# EasyEDA Pro project Amplificador Logaritmo.eprj

# Schematic Amplificador Logaritmo

## Sheets
1 Fontes: Board Name: Amplificador Logaritmo; Create Date: 2026-05-11; Page Name: Fontes; Project Name: Amplificador Logaritmo; Schematic Name: Amplificador Logaritmo; Update Date: 2026-05-12; Company: EasyEDA.com; Page Size: A4; Version: V1.0
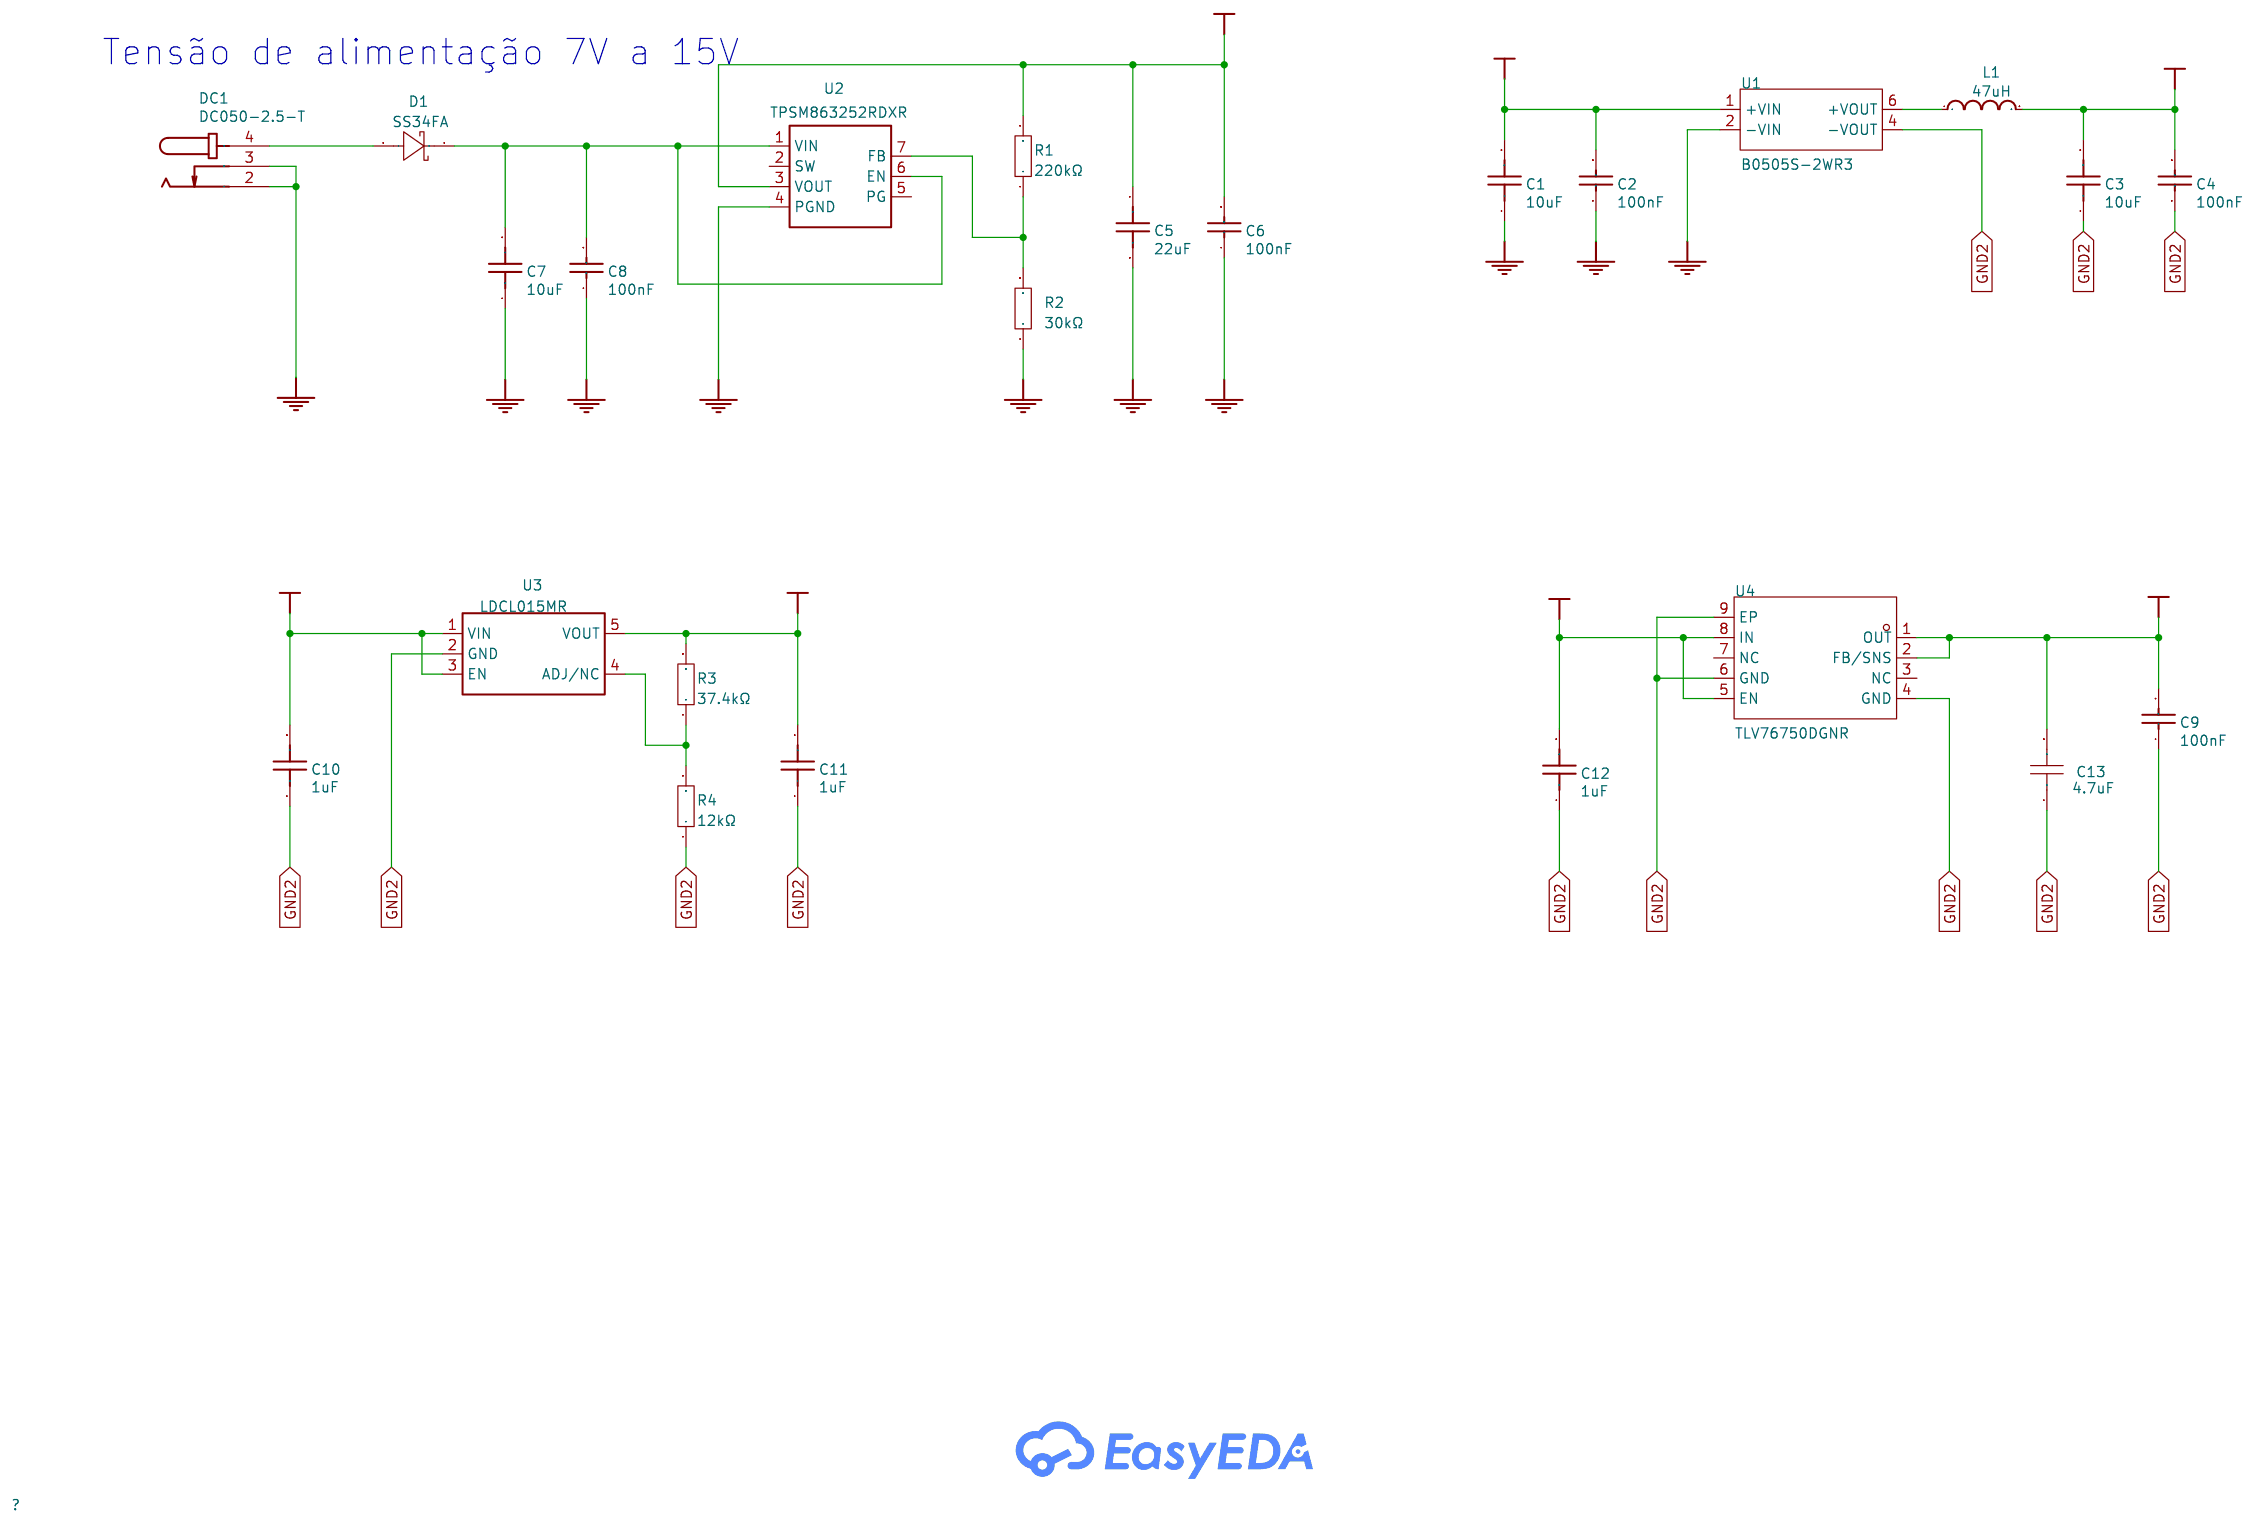
[diagram p0: Fontes]
2 Amplificador 1 e 2: Page Name: Amplificador 1 e 2
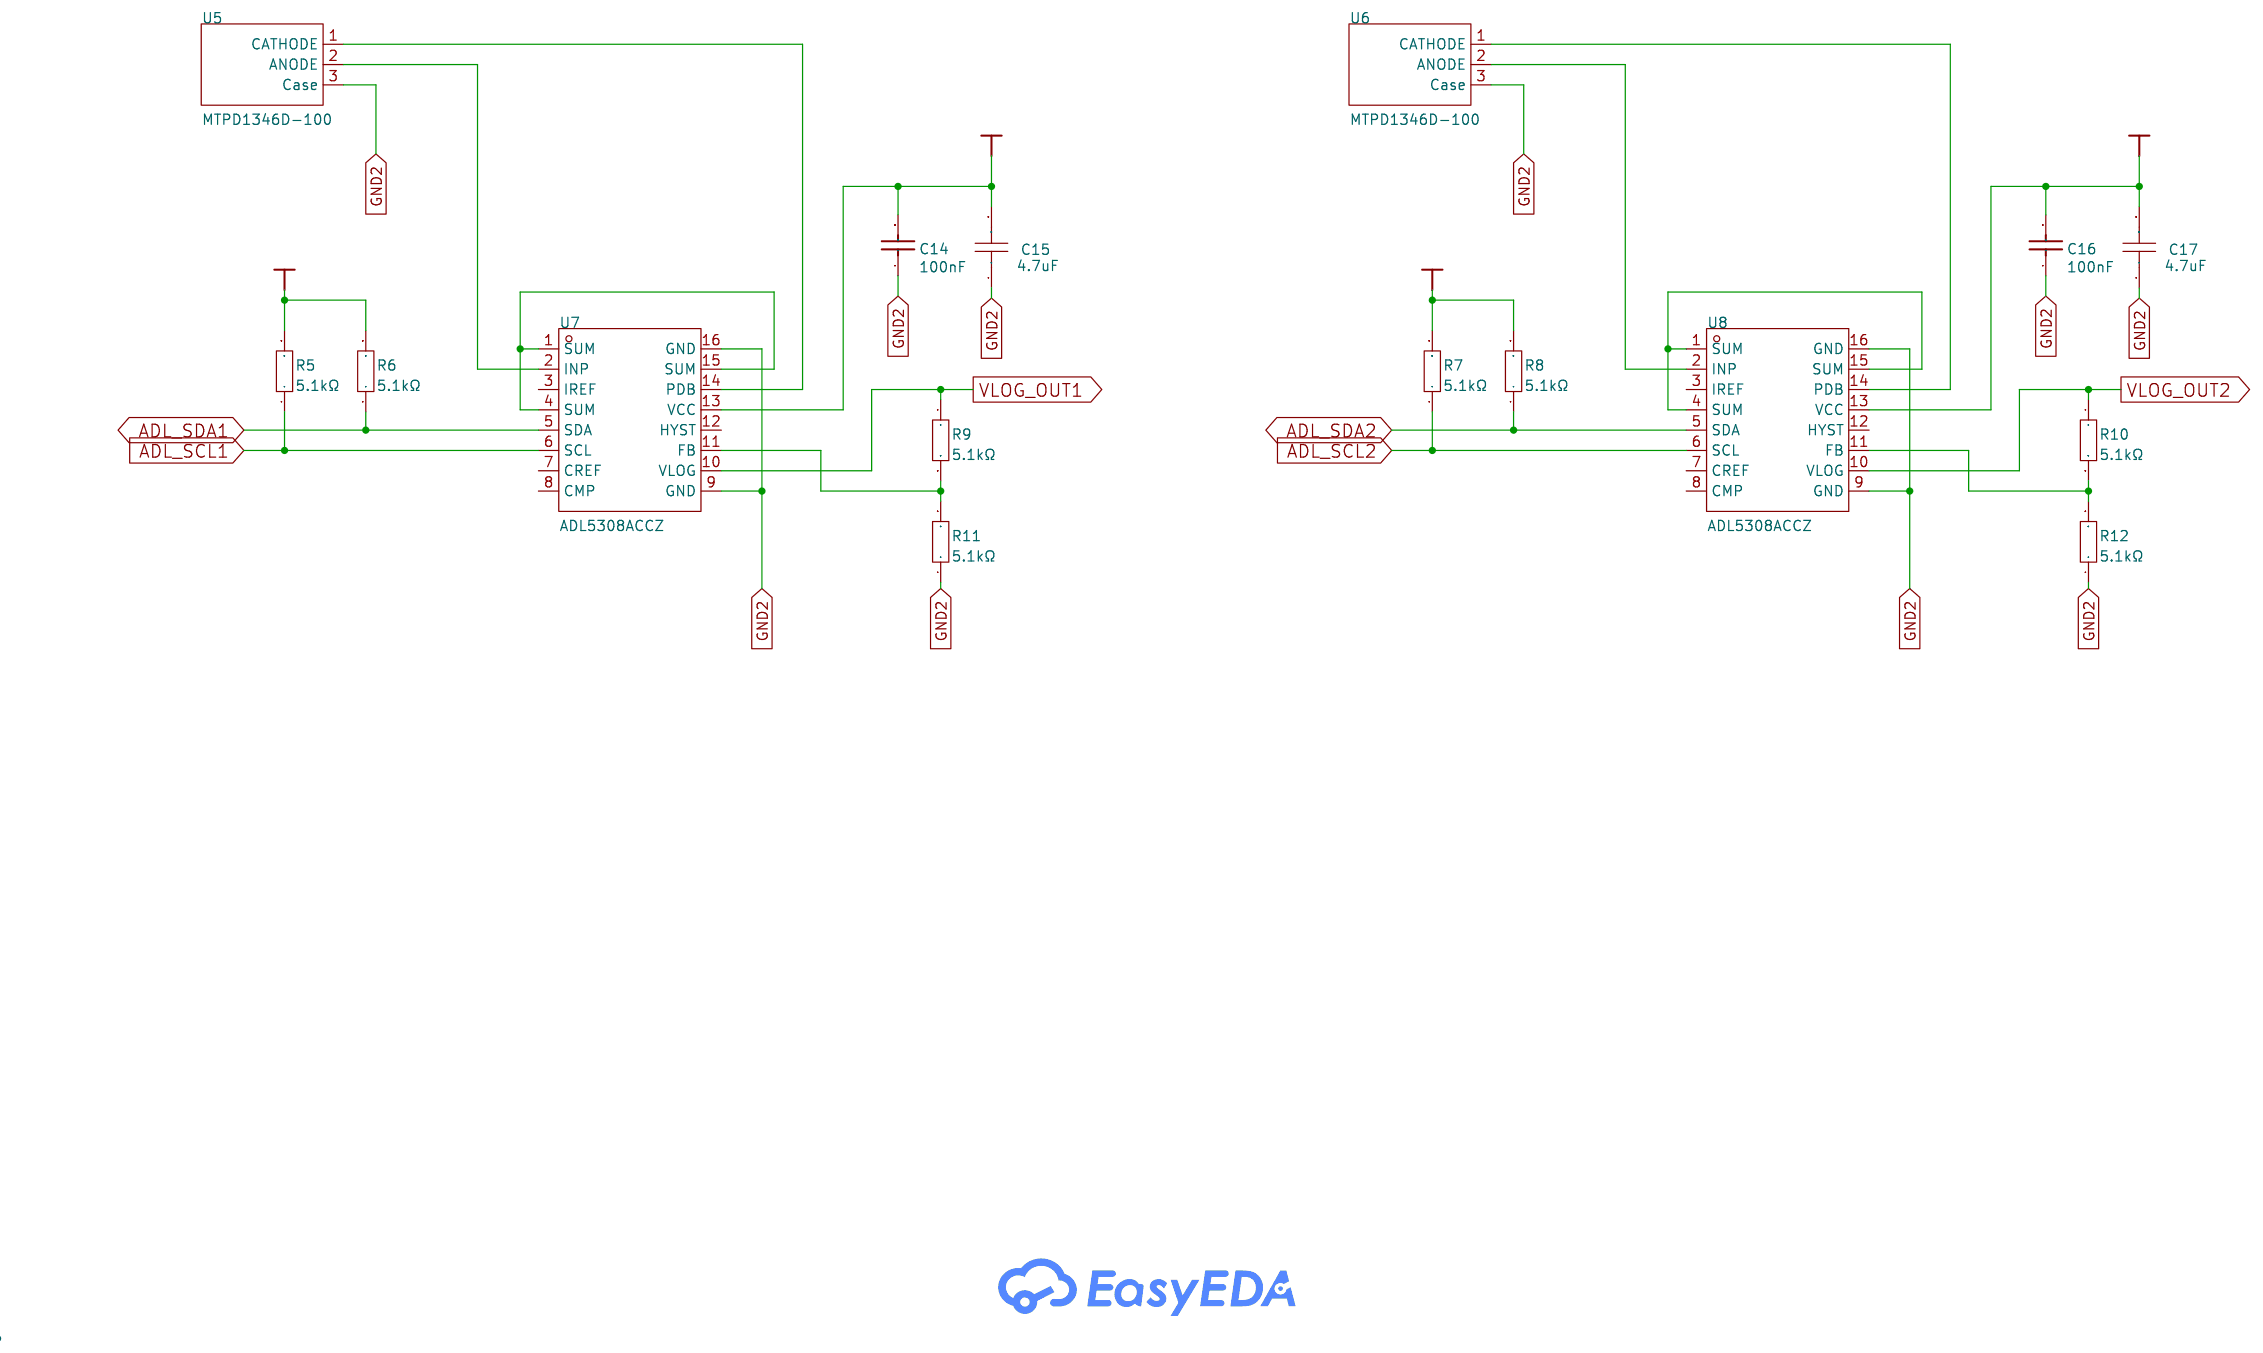
[diagram p1: Amplificador 1 e 2]
3 ADC: Page Name: ADC
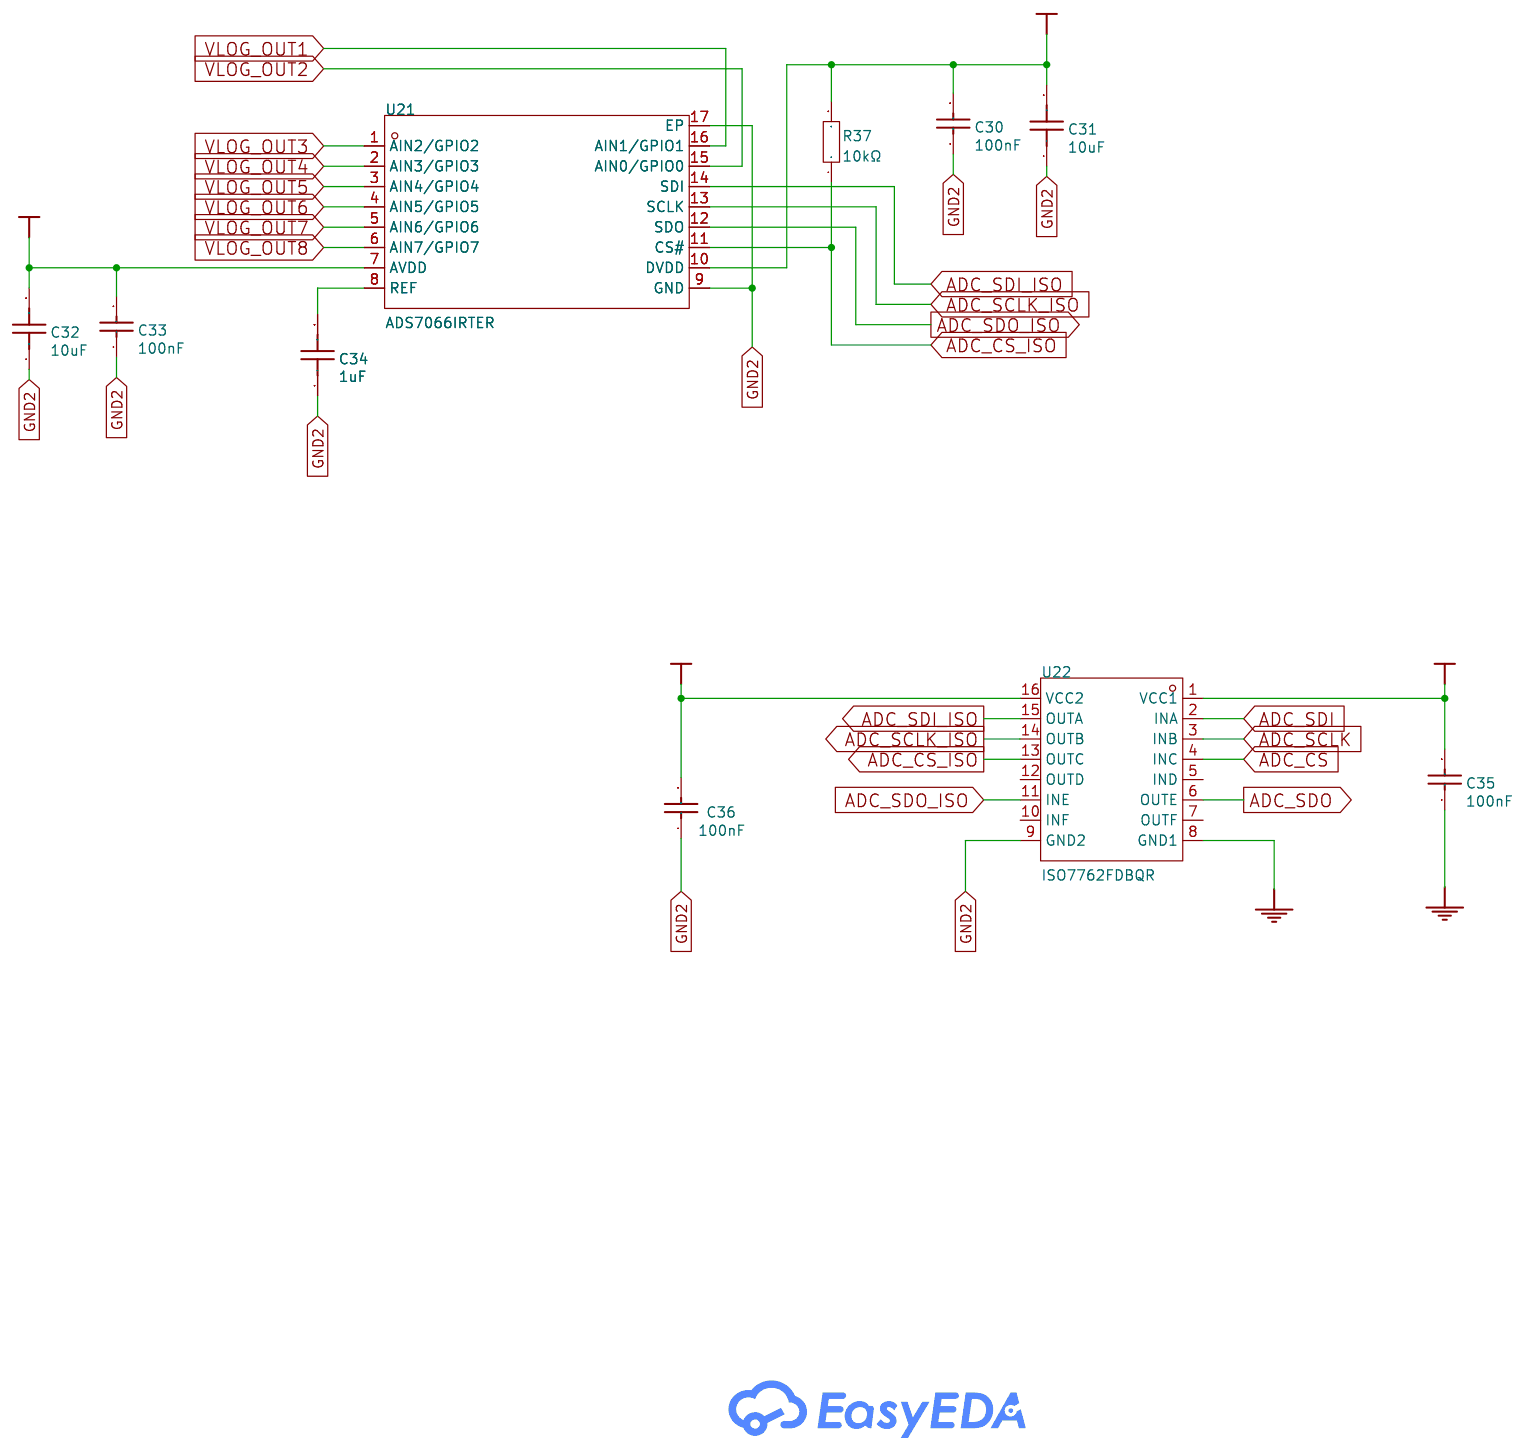
[diagram p2: ADC]
4 Amplificador 3 e 4: Page Name: Amplificador 3 e 4
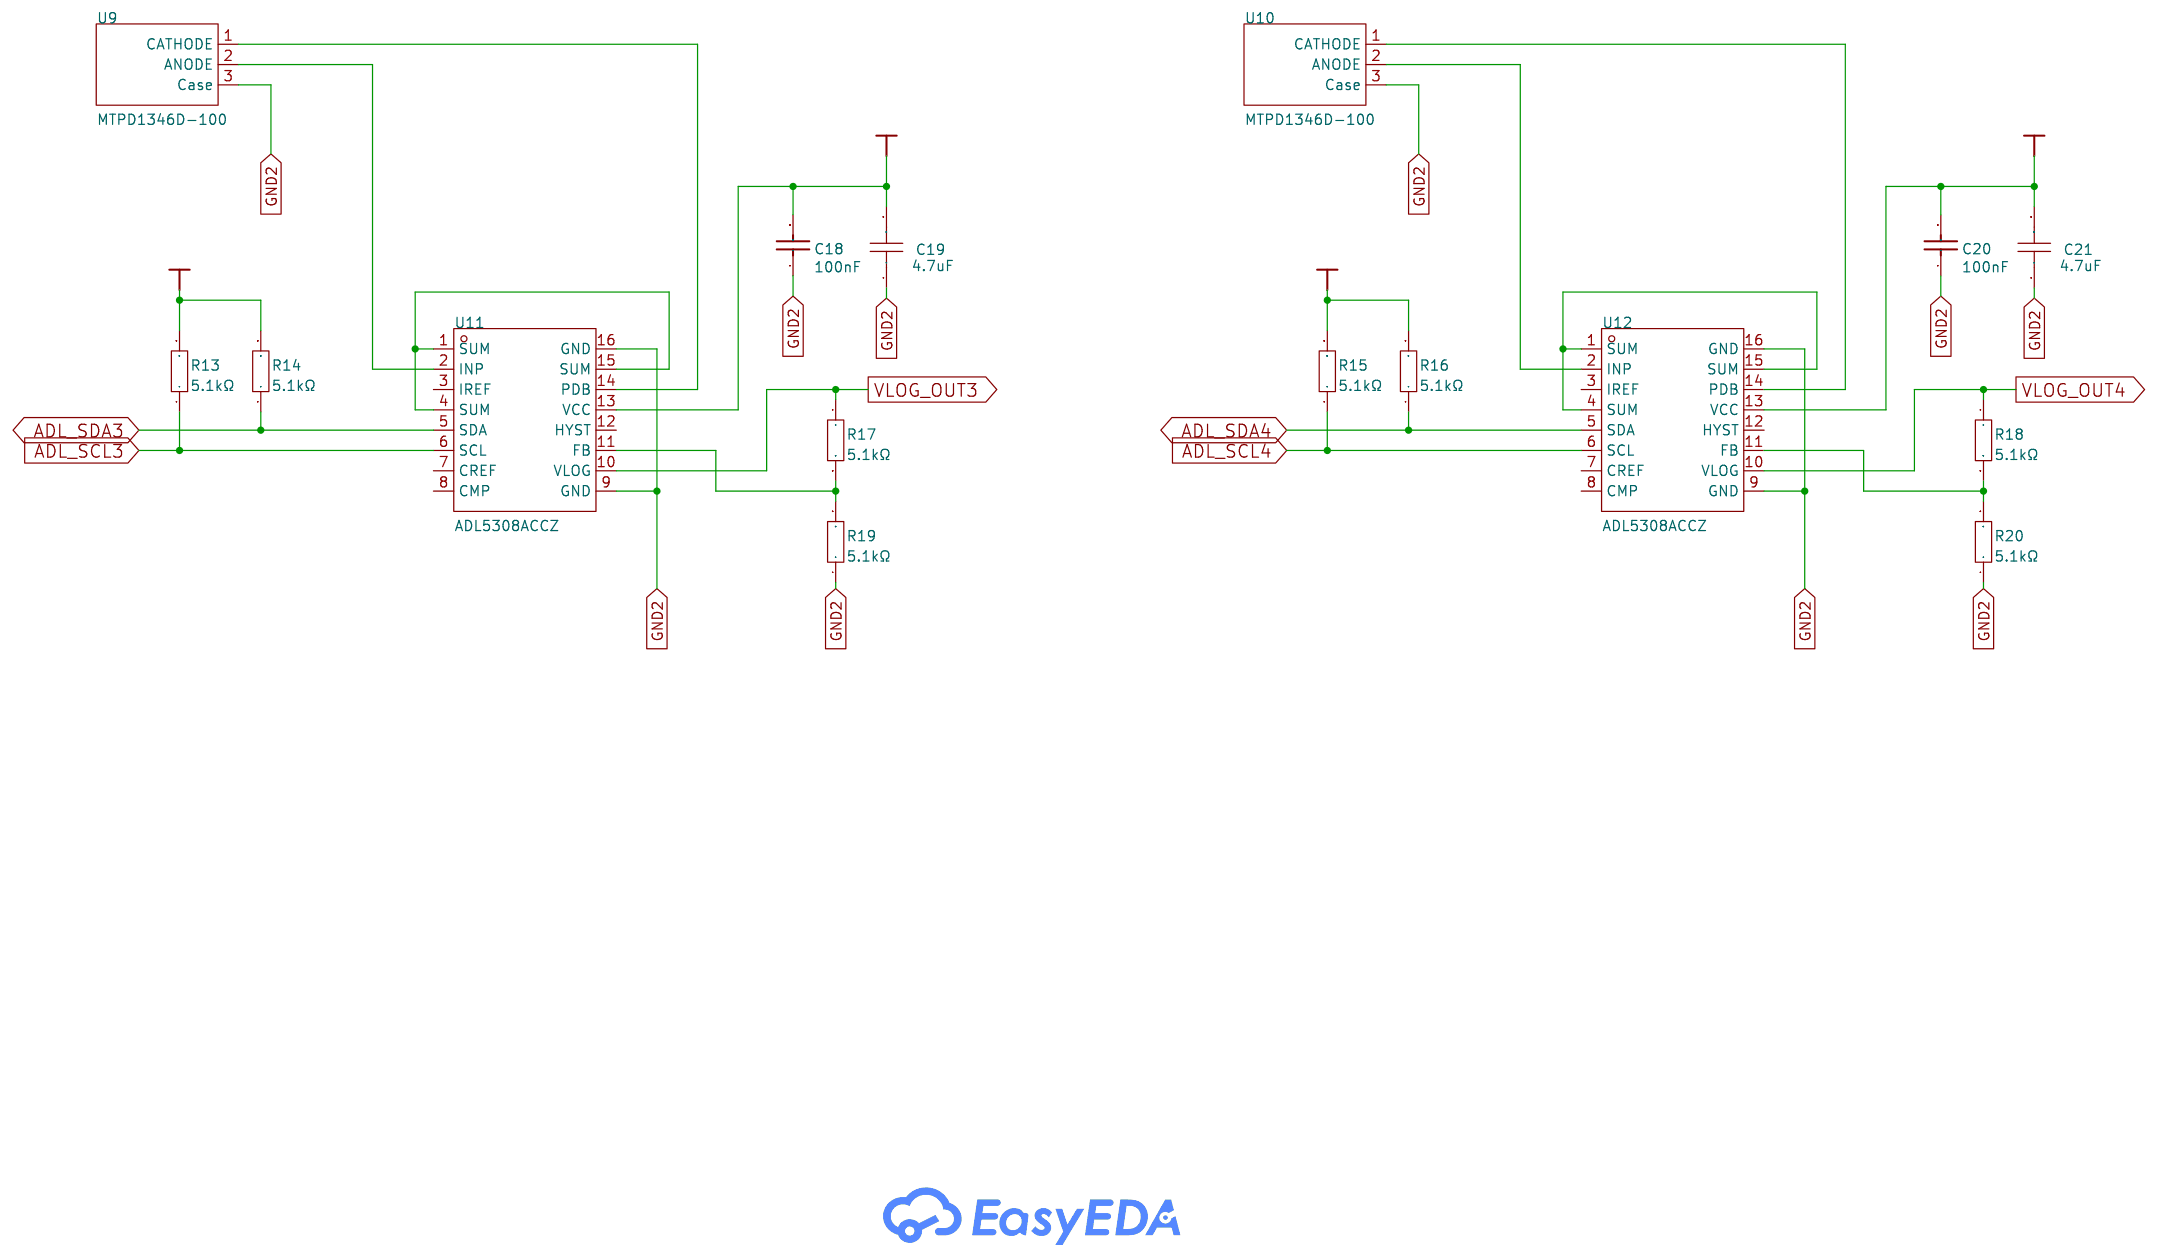
[diagram p3: Amplificador 3 e 4]
5 Amplificador 5 e 6: Page Name: Amplificador 5 e 6
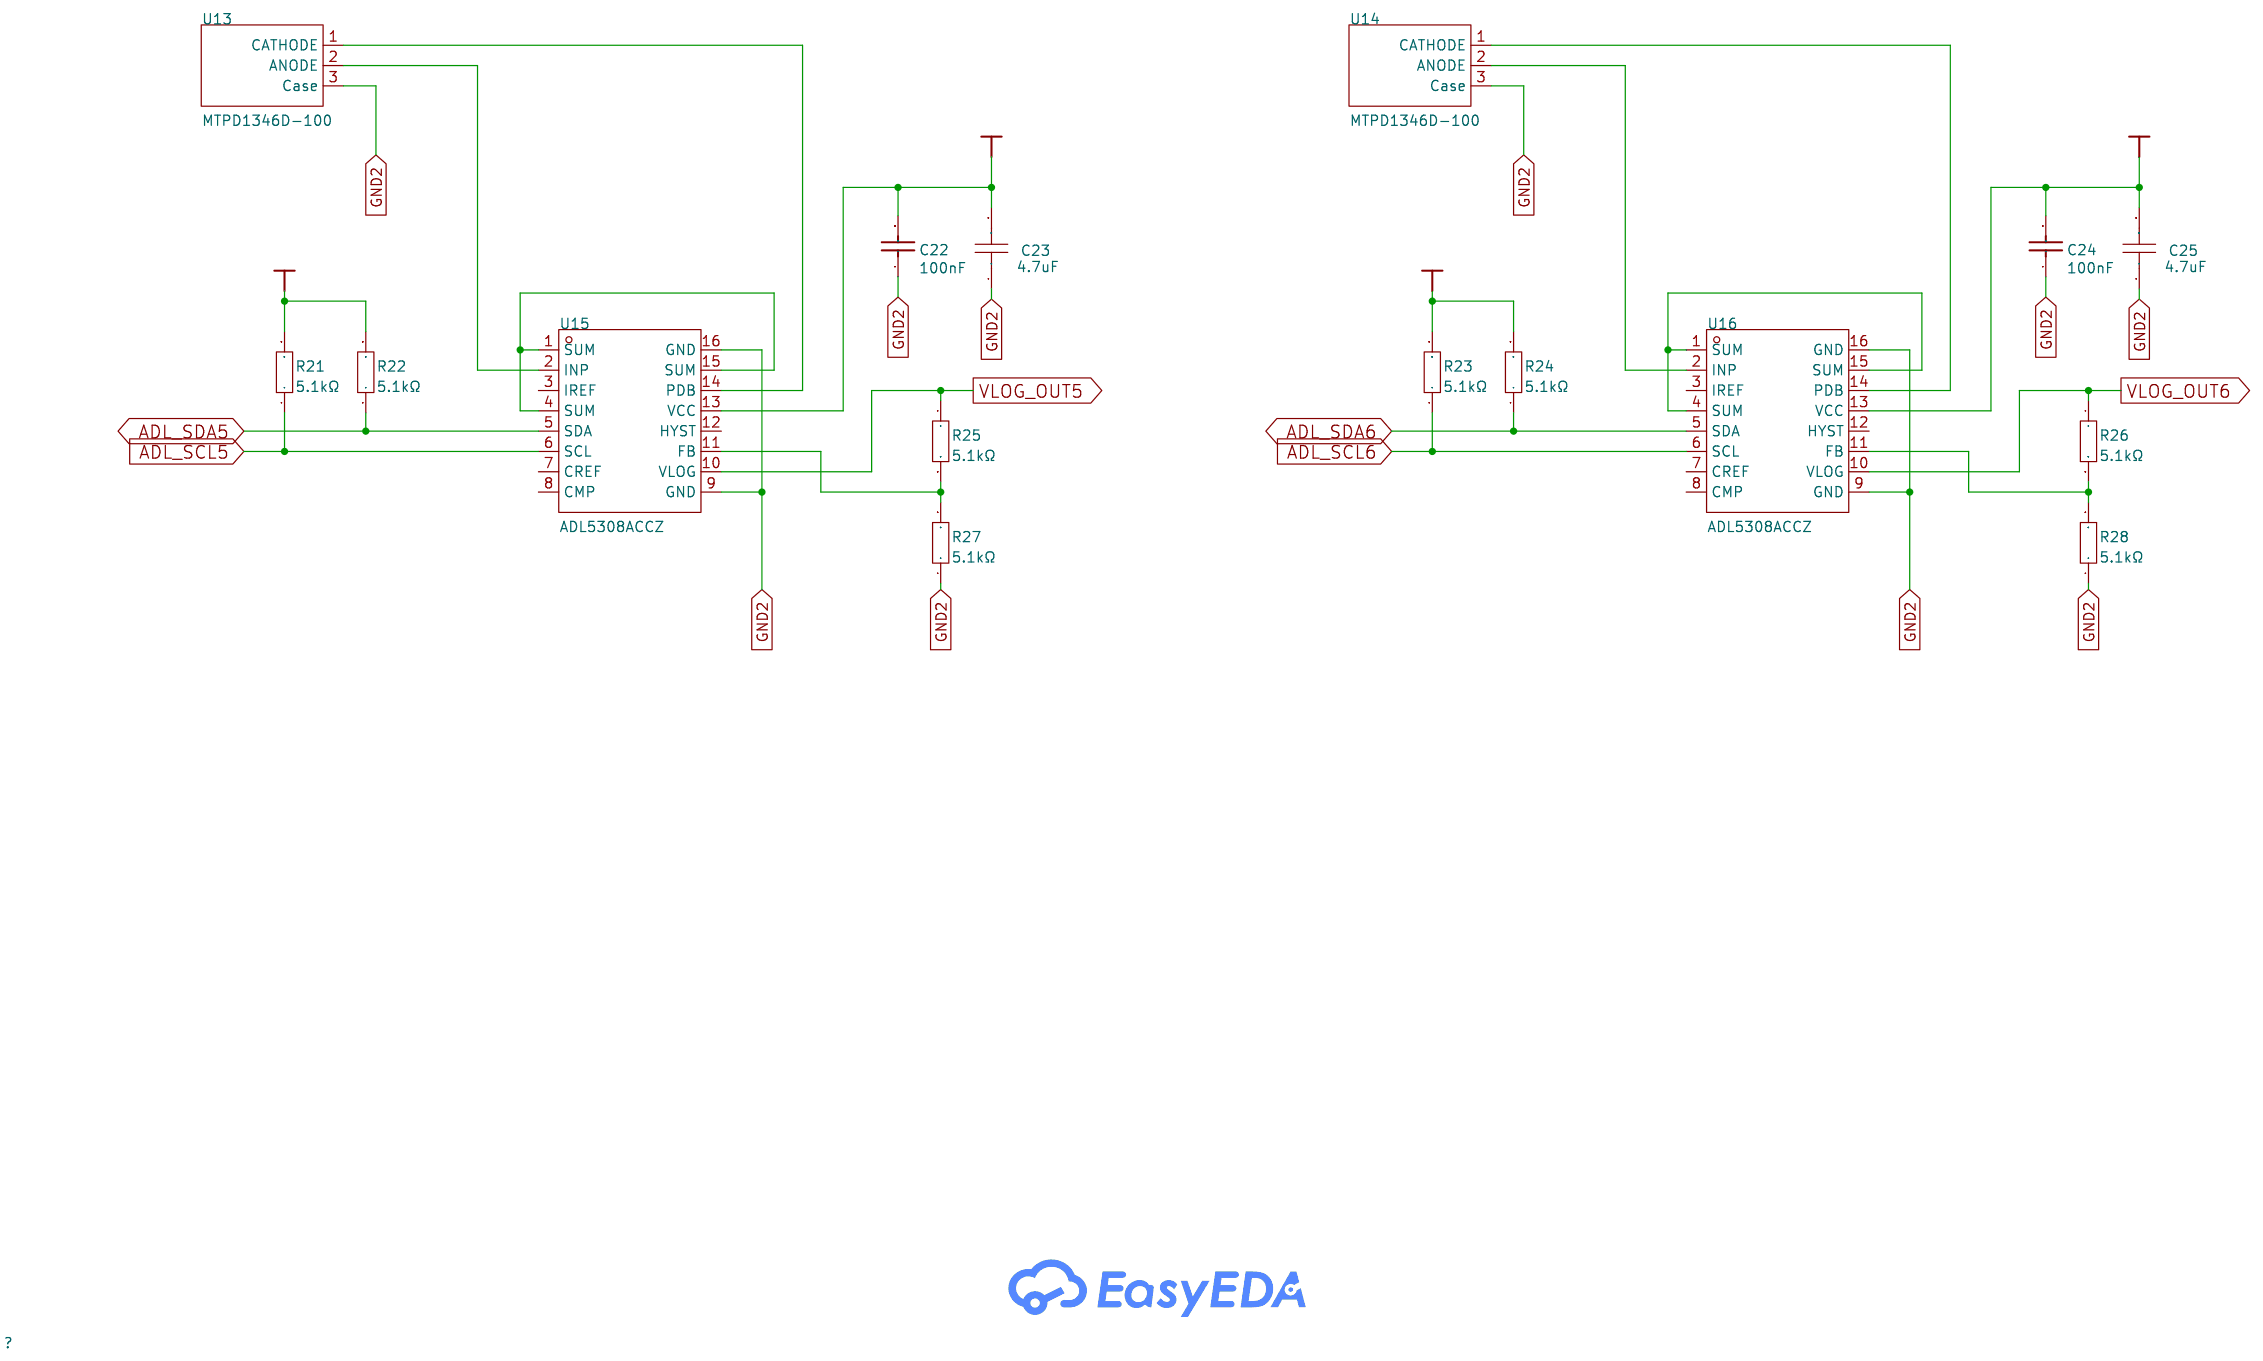
[diagram p4: Amplificador 5 e 6]
6 Amplificador 7 e 8: Page Name: Amplificador 7 e 8
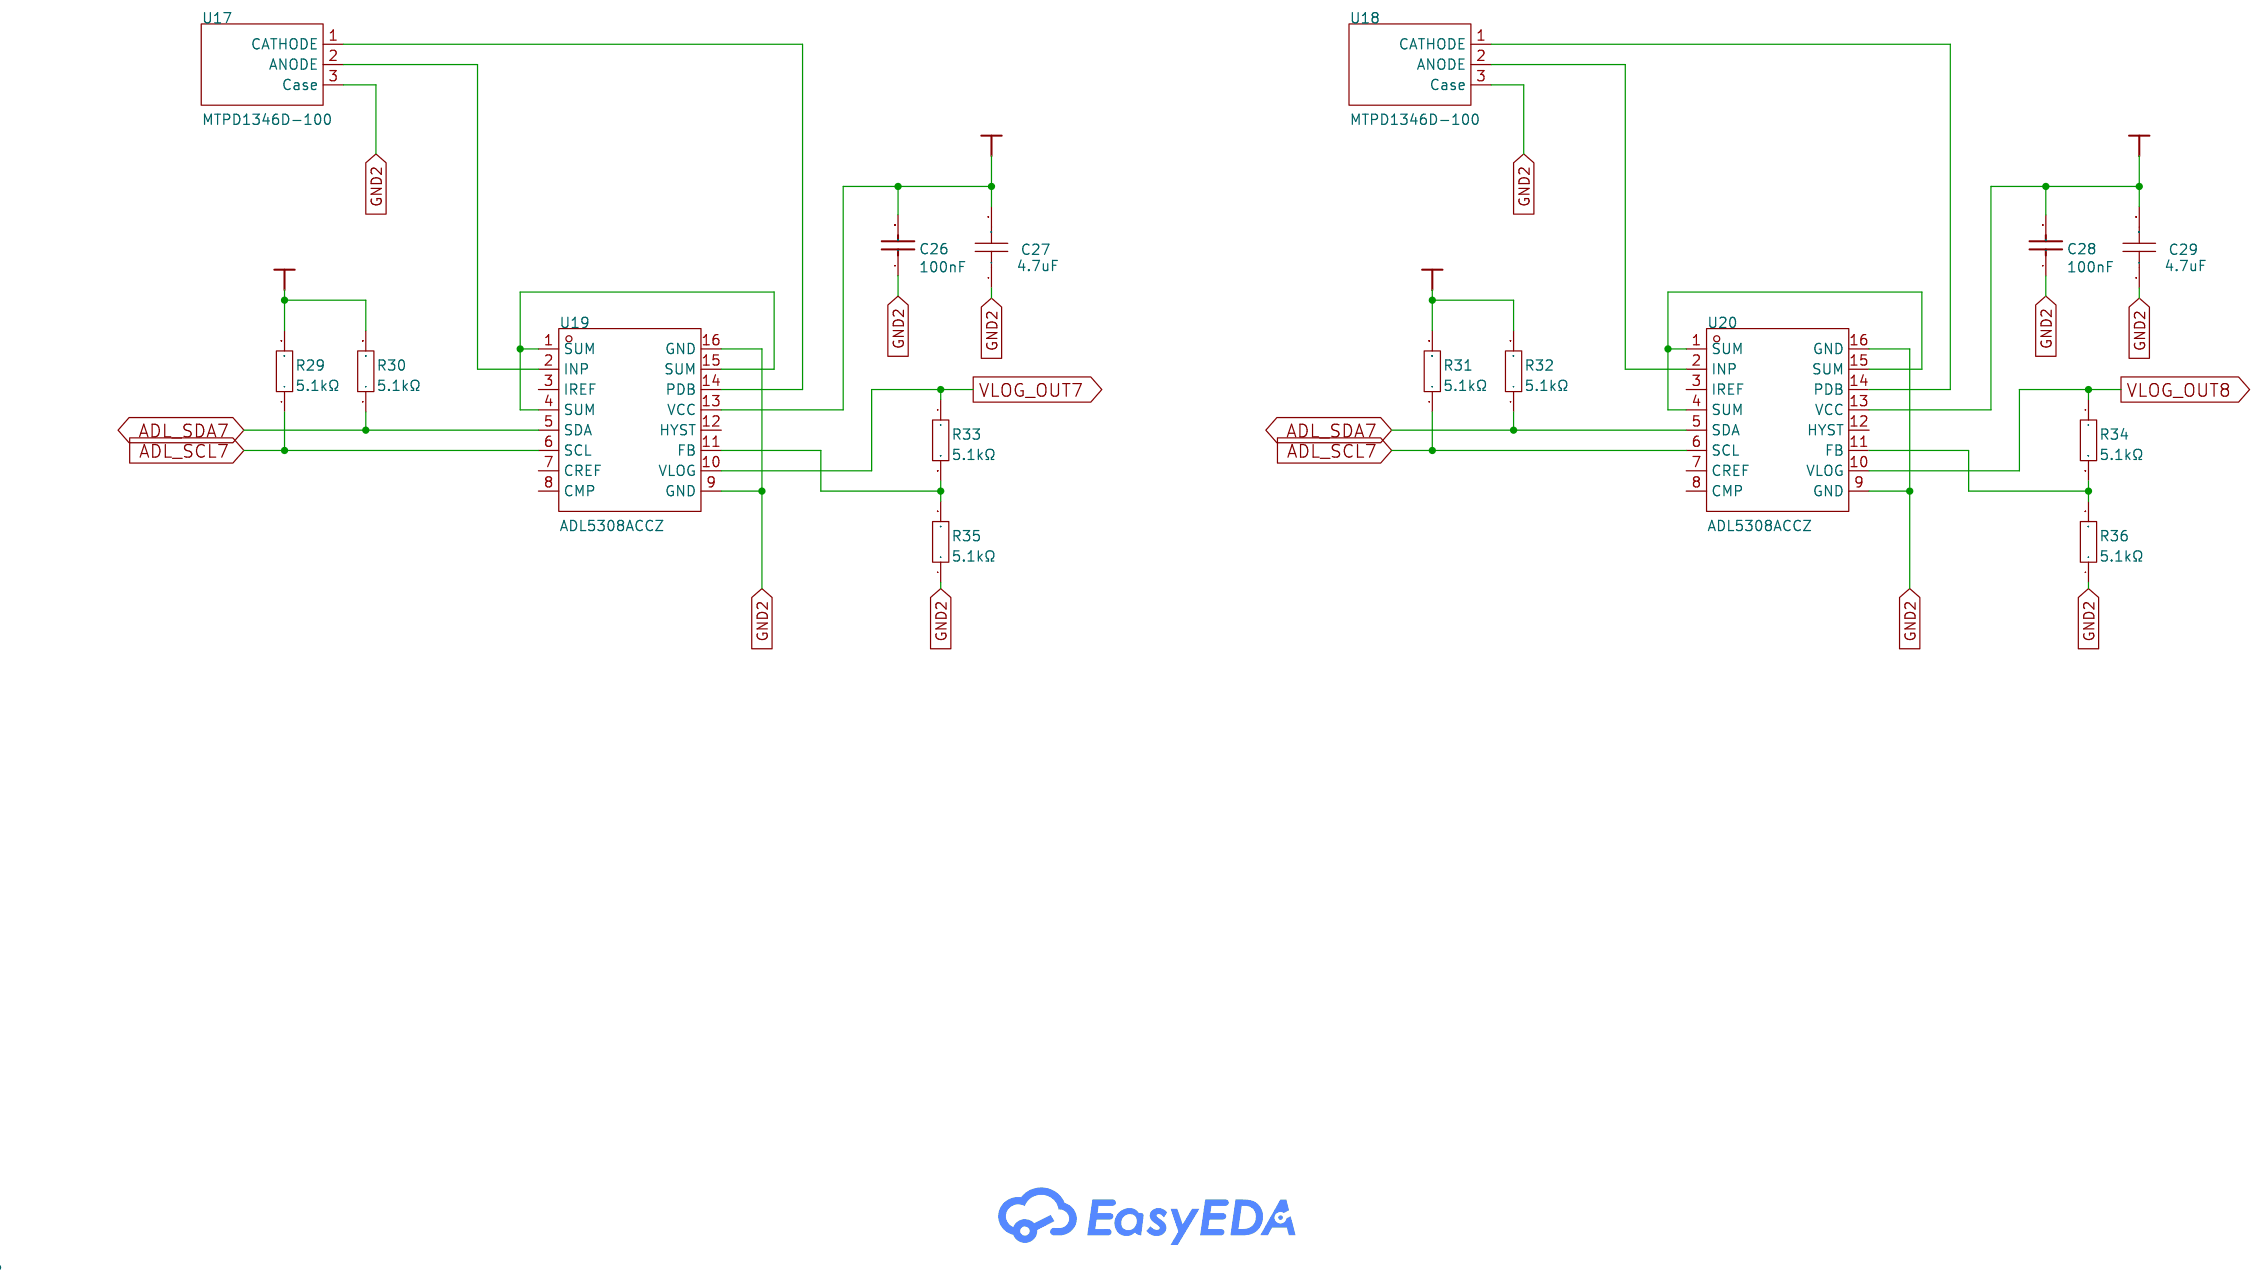
[diagram p5: Amplificador 7 e 8]
7 Interface I2C: Page Name: Interface I2C
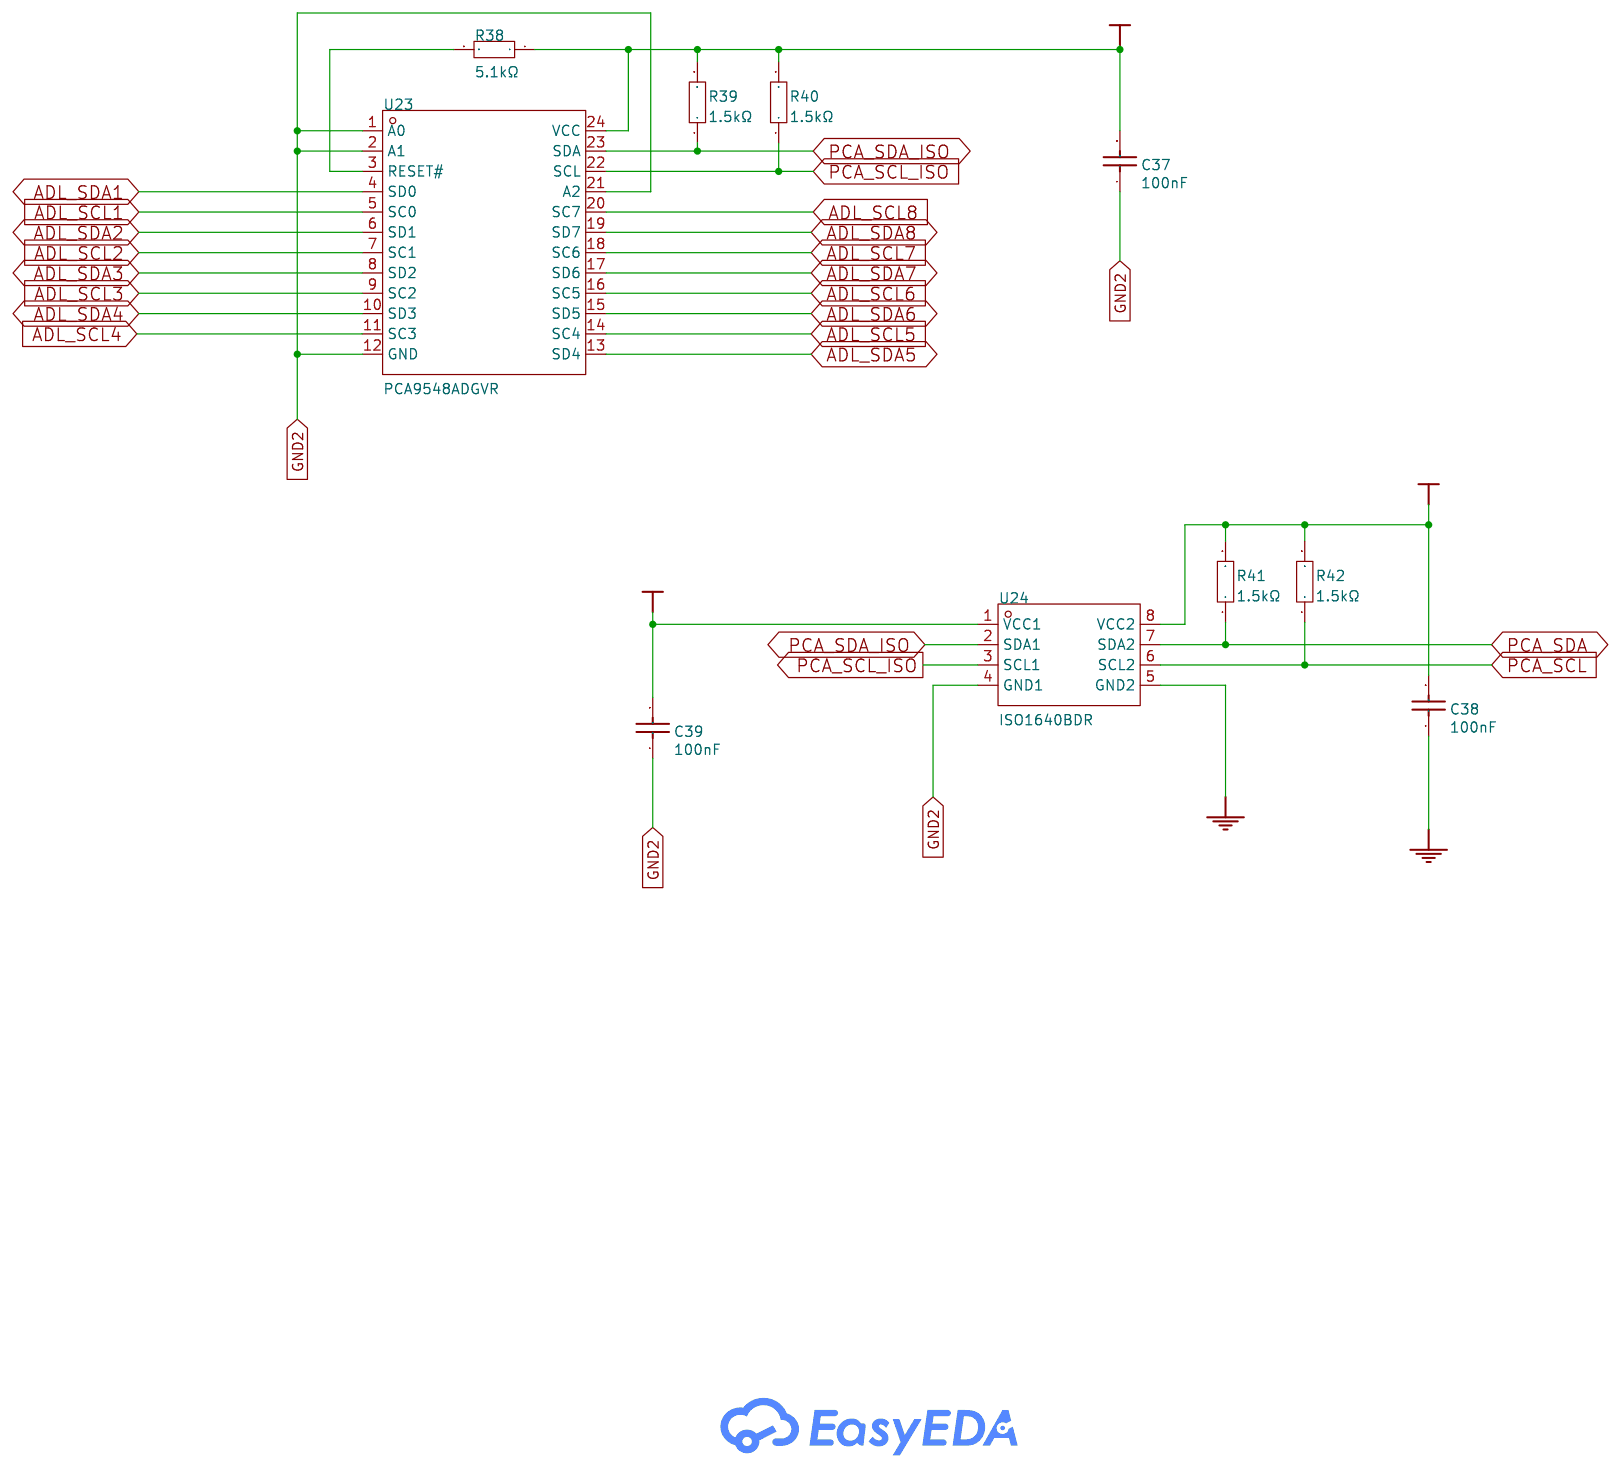
[diagram p6: Interface I2C]

## Parts
sheet ADC
C30  100nF  [C0402]
C31  10uF  [C0402]
C32  10uF  [C0402]
C33  100nF  [C0402]
C34  1uF  [C0402]
C35  100nF  [C0402]
C36  100nF  [C0402]
R37  10kΩ  [R0402]
U21  ADS7066IRTER  [WQFN-16_L3.0-W3.0-P0.50-TL-EP1.7]
U22  ISO7762FDBQR  [SSOP-16_L4.9-W3.9-P0.64-LS6.0-BL]
sheet Amplificador 1 e 2
C14  100nF  [C0402]
C15  4.7uF  [C0402]
C16  100nF  [C0402]
C17  4.7uF  [C0402]
R5  5.1kΩ  [R0402]
R6  5.1kΩ  [R0402]
R7  5.1kΩ  [R0402]
R8  5.1kΩ  [R0402]
R9  5.1kΩ  [R0402]
R10  5.1kΩ  [R0402]
R11  5.1kΩ  [R0402]
R12  5.1kΩ  [R0402]
U5  MTPD1346D-100  [TO-46-3_BD5.4-P1.27-L]
U6  MTPD1346D-100  [TO-46-3_BD5.4-P1.27-L]
U7  ADL5308ACCZ  [LGA-14_L3.0-W2.0-P0.50-TL-EP]
U8  ADL5308ACCZ  [LGA-14_L3.0-W2.0-P0.50-TL-EP]
sheet Amplificador 3 e 4
C18  100nF  [C0402]
C19  4.7uF  [C0402]
C20  100nF  [C0402]
C21  4.7uF  [C0402]
R13  5.1kΩ  [R0402]
R14  5.1kΩ  [R0402]
R15  5.1kΩ  [R0402]
R16  5.1kΩ  [R0402]
R17  5.1kΩ  [R0402]
R18  5.1kΩ  [R0402]
R19  5.1kΩ  [R0402]
R20  5.1kΩ  [R0402]
U9  MTPD1346D-100  [TO-46-3_BD5.4-P1.27-L]
U10  MTPD1346D-100  [TO-46-3_BD5.4-P1.27-L]
U11  ADL5308ACCZ  [LGA-14_L3.0-W2.0-P0.50-TL-EP]
U12  ADL5308ACCZ  [LGA-14_L3.0-W2.0-P0.50-TL-EP]
sheet Amplificador 5 e 6
C22  100nF  [C0402]
C23  4.7uF  [C0402]
C24  100nF  [C0402]
C25  4.7uF  [C0402]
R21  5.1kΩ  [R0402]
R22  5.1kΩ  [R0402]
R23  5.1kΩ  [R0402]
R24  5.1kΩ  [R0402]
R25  5.1kΩ  [R0402]
R26  5.1kΩ  [R0402]
R27  5.1kΩ  [R0402]
R28  5.1kΩ  [R0402]
U13  MTPD1346D-100  [TO-46-3_BD5.4-P1.27-L]
U14  MTPD1346D-100  [TO-46-3_BD5.4-P1.27-L]
U15  ADL5308ACCZ  [LGA-14_L3.0-W2.0-P0.50-TL-EP]
U16  ADL5308ACCZ  [LGA-14_L3.0-W2.0-P0.50-TL-EP]
sheet Amplificador 7 e 8
C26  100nF  [C0402]
C27  4.7uF  [C0402]
C28  100nF  [C0402]
C29  4.7uF  [C0402]
R29  5.1kΩ  [R0402]
R30  5.1kΩ  [R0402]
R31  5.1kΩ  [R0402]
R32  5.1kΩ  [R0402]
R33  5.1kΩ  [R0402]
R34  5.1kΩ  [R0402]
R35  5.1kΩ  [R0402]
R36  5.1kΩ  [R0402]
U17  MTPD1346D-100  [TO-46-3_BD5.4-P1.27-L]
U18  MTPD1346D-100  [TO-46-3_BD5.4-P1.27-L]
U19  ADL5308ACCZ  [LGA-14_L3.0-W2.0-P0.50-TL-EP]
U20  ADL5308ACCZ  [LGA-14_L3.0-W2.0-P0.50-TL-EP]
sheet Fontes
C1  10uF  [C0402]
C2  100nF  [C0402]
C3  10uF  [C0402]
C4  100nF  [C0402]
C5  22uF  [C0603]
C6  100nF  [C0402]
C7  10uF  [C0603]
C8  100nF  [C0402]
C9  100nF  [C0402]
C10  1uF  [C0402]
C11  1uF  [C0402]
C12  1uF  [C0402]
C13  4.7uF  [C0402]
D1  SS34FA  [SOD-123FL_L2.8-W1.8-LS3.6-RD]
DC1  DC050-2.5-T  [DC-IN-SMD_HX-DC050-2.5-T]
L1  47uH  [IND-SMD_L3.2-W2.5-BRL3225T100M]
R1  220kΩ  [R0402]
R2  30kΩ  [R0402]
R3  37.4kΩ  [R0402]
R4  12kΩ  [R0402]
U1  B0505S-2WR3  [PWRM-TH_IBXX05S-2WR3]
U2  TPSM863252RDXR  [QFN-7_L4.0-W3.3_TPSM863257RDXR]
U3  LDCL015MR  [SOT-23-5_L3.0-W1.6-P0.95-LS2.8-BL]
U4  TLV76750DGNR  [HVSSOP-8_L3.0-W3.0-P0.65-LS4.9-BL-EP2.1]
sheet Interface I2C
C37  100nF  [C0402]
C38  100nF  [C0402]
C39  100nF  [C0402]
R38  5.1kΩ  [R0402]
R39  1.5kΩ  [R0402]
R40  1.5kΩ  [R0402]
R41  1.5kΩ  [R0402]
R42  1.5kΩ  [R0402]
U23  PCA9548ADGVR  [TVSOP-24_L5.0-W4.4-P0.40-LS6.4-BL]
U24  ISO1640BDR  [SOIC-8_L4.9-W3.9-P1.27-LS6.0-TL]

## Library data of the parts
C2 C4 C6 C8 C9 C14 C16 C18 C20 C22 C24 C26 C28 C30 C33 C35-C39 = 100nF: Supplier: LCSC; Manufacturer: muRata(村田); Supplier Part: C85858; JLCPCB Part Class: Extended Part; nameAlias: Value; Manufacturer Part: GCM155R71H104KE02D; spicePre: C; spiceSymbolName: GCM155R71H104KE02D
C1 C3 C31 C32 = GRM155R61A106ME44D: Capacitance:10uF Tolerance:±20% Tolerance:±20% Voltage Rating:10V Temperature Coefficient:X5R; LCSC Part Name: 10uF ±20% 10V; Supplier Part: C77000; Manufacturer: muRata(村田); Supplier Footprint: 0402; JLCPCB Part Class: Extended Part; Datasheet: https://item.szlcsc.com/datasheet/GRM155R61A106ME44D/78127.html; Supplier: LCSC; Tolerance: ±20%; Voltage Rating: 10V; Temperature Coefficient: X5R
C10-C12 C34 = 1uF: Supplier: LCSC; Supplier Part: C528974; Manufacturer: muRata(村田); JLCPCB Part Class: Extended Part; nameAlias: Value; Contributor: LCSC; Manufacturer Part: GRM155Z71A105KE01D; spicePre: C; spiceSymbolName: GRM155Z71A105KE01D
R37 = RC0402FR-0710KL: LCSC Part Name: 厚膜电阻 10kΩ ±1% 62.5mW; Supplier Part: C60490; Manufacturer: YAGEO(国巨); Supplier Footprint: 0402; JLCPCB Part Class: Extended Part; Datasheet: https://item.szlcsc.com/datasheet/RC0402FR-0710KL/61542.html; Supplier: LCSC; Type: Thick Film Resistor; Tolerance: ±1%; Power(Watts): 62.5mW; Voltage-Supply(Max): 50V; Temperature Coefficient: ±100ppm/℃; Operating Temperature: -55℃~+155℃
U21 = ADS7066IRTER: LCSC Part Name: 小型8通道16位SAR ADC; Supplier Part: C31435469; Manufacturer: TI(德州仪器); Supplier Footprint: WQFN-16-EP(3x3); JLCPCB Part Class: Extended Part; Datasheet: https://www.ti.com.cn/cn/lit/ds/symlink/ads7066.pdf?ts=1738808152575&ref_url=https%253A%252F%252Fwww.ti.com.cn%252Fsitesearch%252Fzh-cn%252Fdocs%252Funiversalsearch.tsp%253FlangPref%253Dzh-CN%2526nr%253D9%2526searchTerm%253DADS7066IRTER; Supplier: LCSC; Resolution(Bits): 16; number of channels: 8; Voltage - Supply: 3V~5.5V；1.65V~5.5V; Interface: SPI; differential input: No; Integral non - linearity: 1LSB; Operating Temperature: -40℃~+125℃; Signal-to-Noise Ratio: 91.9dB; Clock/Oscillator: Built-in; Clock Frequency: 60MHz; Voltage Reference: Built-in; Voltage Reference Drift: 6ppm/℃; ADC architecture: SAR; Quiescent Current (Iq): 1.2mA; Full-Scale Range(FSR): 2.5V
U22 = ISO7762FDBQR: LCSC Part Name: 高速、增强型六通道数字隔离器; Supplier Part: C2877506; Manufacturer: TI(德州仪器); Supplier Footprint: SSOP-16-150mil; JLCPCB Part Class: Extended Part; Datasheet: https://www.ti.com/cn/lit/gpn/iso7763; Supplier: LCSC; Number of Forward Channels: 4; Number of Reverse Channels: 2; Data Rate(Max): 100Mbps; Default Output: Low Level; Isolation Voltage(Vrms): 3000; CMTI(kV/us): 100kV/us; Operating Temperature: -55℃~+125℃; Voltage - Supply(VCCA): 2.25V~5.5V; Voltage - Supply(VCCB): 2.25V~5.5V; Propagation Delay(tpd): 11ns
C13 C15 C17 C19 C21 C23 C25 C27 C29 = GRM155R61A475MEAAD: LCSC Part Name: 4.7uF ±20% 10V; Supplier Part: C335105; Manufacturer: muRata(村田); Supplier Footprint: 0402; JLCPCB Part Class: Extended Part; Datasheet: https://atta.szlcsc.com/upload/public/pdf/source/20200305/C490387_23319AE8C154DEB24C505E6C82A8106A.pdf; Supplier: LCSC; Tolerance: ±20%
R5-R36 R38 = RC0402FR-075K1L: LCSC Part Name: 厚膜电阻 5.1kΩ ±1% 62.5mW; Supplier Part: C105872; Manufacturer: YAGEO(国巨); Supplier Footprint: 0402; JLCPCB Part Class: Extended Part; Datasheet: https://item.szlcsc.com/datasheet/RC0402FR-075K1L/107087.html; Supplier: LCSC; Type: Thick Film Resistor; Tolerance: ±1%; Power(Watts): 62.5mW; Voltage-Supply(Max): 50V; Temperature Coefficient: ±100ppm/℃; Operating Temperature: -55℃~+155℃
U5 U6 U9 U10 U13 U14 U17 U18 = MTPD1346D-100: Supplier Part: C3210926; Manufacturer: Marktech Optoelectronics; Supplier Footprint: TO-46-3; JLCPCB Part Class: Extended Part; Datasheet: https://atta.szlcsc.com/upload/public/pdf/source/20240129/6B4FD96B32FDFE220F2F1B8CFE0CE41A.pdf; Supplier: LCSC; DC Reverse Voltage: 5V; Peak Wavelength: 1300nm; Spectral Range: 800nm~1750nm; Dark Current: 200nA; Operating Temperature: -40℃~+85℃
U7 U8 U11 U12 U15 U16 U19 U20 = ADL5308ACCZ: LCSC Part Name: 快速响应、宽动态范围的对数转换器，适用于光纤系统信号电平监测，具备自适应光电二极管偏置和内置比较器; Supplier Part: C22394450; Manufacturer: ADI(亚德诺); Supplier Footprint: LGA-14(2x3); JLCPCB Part Class: Extended Part; Datasheet: https://item.szlcsc.com/datasheet/ADL5308ACCZ/23988558.html; Supplier: LCSC; Amplifier Type: Logarithmic Amplifier; Operating Temperature: -40℃~+105℃; Maximum Power Supply Range (Vdd-Vss): 5.25V; Gain Bandwidth Product: 0.97MHz; Quiescent Current: 32000000nA; Single Supply: 4.75V~5.25V; Features: Digital interface control
C5 = 22uF: Supplier: LCSC; Manufacturer: SAMSUNG(三星); Supplier Part: C2762594; JLCPCB Part Class: Extended Part; Contributor: lcsc; Manufacturer Part: CL10A226MO7JZNC; nameAlias: Value; spicePre: C; spiceSymbolName: CL10A226MO7JZNC
C7 = 10uF: Supplier: LCSC; Supplier Part: C96446; Manufacturer: SAMSUNG(三星); JLCPCB Part Class: Basic Part; nameAlias: Value; Manufacturer Part: CL10A106MA8NRNC; spicePre: C; spiceSymbolName: CL10A106MA8NRNC
D1 = SS34FA: Diode Configuration:Independent Voltage - Forward(Vf@If):500mV@3A Voltage - DC Reverse(Vr):40V Current - Rectified:3A Reverse Leakage Current (Ir):500uA@40V Operating Junction Temperature Range:-55℃~+125℃ Operating Junction Temperature Range:-55℃~+125℃ No; LCSC Part Name: 电压:40V 电流:3A; Supplier Part: C719833; Manufacturer: onsemi(安森美); Supplier Footprint: SOD-123FL; JLCPCB Part Class: Extended Part; Datasheet: https://item.szlcsc.com/datasheet/SS34FA/762692.html; Supplier: LCSC; Diode Configuration: Independent; Voltage - Forward(Vf@If): 500mV@3A; Voltage - DC Reverse(Vr): 40V; Current - Rectified: 3A; Reverse Leakage Current (Ir): 500uA@40V; Operating Junction Temperature Range: -55℃~+125℃; Non-Repetitive Peak Forward Surge Current: 80A
DC1 = DC050-2.5-T: Supplier: LCSC; Supplier Part: C17701687; Manufacturer: SHOU HAN(首韩); JLCPCB Part Class: Extended Part; Contributor: lcsc; spicePre: D
L1 = 47uH: Supplier: LCSC; Supplier Part: C524993; Manufacturer: TAIYO YUDEN(太诱); Manufacturer Part: BRL3225T470K; JLCPCB Part Class: Extended Part; nameAlias: Value; Contributor: LCSC; spicePre: L
R1 = RC0402FR-07220KL: LCSC Part Name: 厚膜电阻 220kΩ ±1% 62.5mW; Supplier Part: C138030; Manufacturer: YAGEO(国巨); Supplier Footprint: 0402; JLCPCB Part Class: Extended Part; Datasheet: https://item.szlcsc.com/datasheet/RC0402FR-07220KL/149346.html; Supplier: LCSC; Type: Thick Film Resistor; Tolerance: ±1%; Power(Watts): 62.5mW; Voltage-Supply(Max): 50V; Temperature Coefficient: ±100ppm/℃; Operating Temperature: -55℃~+155℃
R2 = RC0402FR-0730KL: Type:Thick Film Resistor Resistance:30kΩ Tolerance:±1% Tolerance:±1% Power(Watts):62.5mW Voltage-Supply(Max):50V Temperature Coefficient:±100ppm/℃ Temperature Coefficient:±100ppm/℃ Operating Temperature:-55℃~+155℃ Operating Temperature:-55℃~+155℃; LCSC Part Name: 厚膜电阻 30kΩ ±1% 62.5mW; Supplier Part: C138008; Manufacturer: YAGEO(国巨); Supplier Footprint: 0402; JLCPCB Part Class: Extended Part; Datasheet: https://item.szlcsc.com/datasheet/RC0402FR-0730KL/149324.html; Supplier: LCSC; Type: Thick Film Resistor; Tolerance: ±1%; Power(Watts): 62.5mW; Voltage-Supply(Max): 50V; Temperature Coefficient: ±100ppm/℃; Operating Temperature: -55℃~+155℃
R3 = AC0402FR-0737K4L: Type:Thick Film Resistors Resistance: Tolerance:±1% Tolerance:±1% Power(Watts): Overload Voltage (Max): Temperature Coefficient:±100ppm/℃ Temperature Coefficient:±100ppm/℃ Operating Temperature Range:-55℃~+155℃ Operating Temperature Range:-55℃~+155℃; LCSC Part Name: 厚膜电阻 37.4kΩ ±1% 62.5mW; Supplier Part: C227021; Manufacturer: YAGEO(国巨); Supplier Footprint: 0402; JLCPCB Part Class: Extended Part; Datasheet: https://atta.szlcsc.com/upload/public/pdf/source/20180927/C229861_4ABDC471507C1ED6AFB4BA66AFC8620A.pdf; Supplier: LCSC; Type: Thick Film Resistors; Tolerance: ±1%; Temperature Coefficient: ±100ppm/℃; Operating Temperature Range: -55℃~+155℃
R4 = RC0402FR-0712KL: Type:Thick Film Resistor Resistance:12kΩ Tolerance:±1% Tolerance:±1% Power(Watts):62.5mW Voltage-Supply(Max):50V Temperature Coefficient:±100ppm/℃ Temperature Coefficient:±100ppm/℃ Operating Temperature:-55℃~+155℃ Operating Temperature:-55℃~+155℃; LCSC Part Name: 厚膜电阻 12kΩ ±1% 62.5mW; Supplier Part: C114760; Manufacturer: YAGEO(国巨); Supplier Footprint: 0402; JLCPCB Part Class: Extended Part; Datasheet: https://item.szlcsc.com/datasheet/RC0402FR-0712KL/116004.html; Supplier: LCSC; Type: Thick Film Resistor; Tolerance: ±1%; Power(Watts): 62.5mW; Voltage-Supply(Max): 50V; Temperature Coefficient: ±100ppm/℃; Operating Temperature: -55℃~+155℃
U1 = B0505S-2WR3_C5365300: LCSC Part Name: 直流隔离电源模块5V转5V短路保护; Supplier Part: C5365300; Manufacturer: HI-LINK(海凌科); Supplier Footprint: SIP,19.5x7mm; JLCPCB Part Class: Extended Part; Datasheet: https://item.szlcsc.com/datasheet/B0505S-2WR3/6196391.html; Supplier: LCSC; Voltage - Supply: 4.5V~5.5V; Output Voltage: 5V; Output Current(Max): 400mA; Output Power: 2W; Features: Short Circuit Protection
U2 = TPSM863252RDXR: Supplier: LCSC; Supplier Part: C19632640; Manufacturer: TI(德州仪器); JLCPCB Part Class: Extended Part; Contributor: lcsc; spicePre: U
U3 = LDCL015MR: Supplier: LCSC; Supplier Part: C2688676; Manufacturer: ST(意法半导体); JLCPCB Part Class: Extended Part; Contributor: LCSC; spicePre: U
U4 = TLV76750DGNR: LCSC Part Name: 5V 1A 16V; Supplier Part: C3752807; Manufacturer: TI(德州仪器); Supplier Footprint: HVSSOP-8; JLCPCB Part Class: Extended Part; Datasheet: https://www.ti.com/cn/lit/gpn/tlv767; Supplier: LCSC; Output Type: Fixed; Voltage - Supply: 16V; Output Voltage: 5V; Output Current: 1A; Power Supply Rejection Ratio (PSRR): 70dB@(1kHz); Voltage Dropout: 1.5V@(1A); standby current: 50uA; Noise: 60uVrms; Features: Over Current Protection；Over Temperature Protection；Soft Start; Operating Temperature: -40℃~+125℃@(Tj); Output Configuration: Positive; Number of Outputs: 1
R39-R42 = RC0402FR-071K5L: LCSC Part Name: 厚膜电阻 1.5kΩ ±1% 62.5mW; Supplier Part: C114759; Manufacturer: YAGEO(国巨); Supplier Footprint: 0402; JLCPCB Part Class: Extended Part; Datasheet: https://item.szlcsc.com/datasheet/RC0402FR-071K5L/116003.html; Supplier: LCSC; Type: Thick Film Resistor; Tolerance: ±1%; Power(Watts): 62.5mW; Voltage-Supply(Max): 50V; Temperature Coefficient: ±100ppm/℃; Operating Temperature: -55℃~+155℃
U23 = PCA9548ADGVR: LCSC Part Name: 支持复位的低电压8通道IC开关; Supplier Part: C2674421; Manufacturer: TI(德州仪器); Supplier Footprint: TVSOP-20; JLCPCB Part Class: Extended Part; Datasheet: https://www.ti.com/cn/lit/gpn/pca9548a; Supplier: LCSC
U24 = ISO1640BDR: LCSC Part Name: 具有增强EMC和GPIO的ISO164x热插拔双向I2C隔离器; Supplier Part: C5122339; Manufacturer: TI(德州仪器); Supplier Footprint: SOIC-8; JLCPCB Part Class: Extended Part; Datasheet: https://item.szlcsc.com/datasheet/ISO1640BDR/5712695.html; Supplier: LCSC

## Nets
+3.3V_ISO_LDO: C11.2 C37.2 C39.2 R3.2 R5.2 R6.2 R7.2 R8.2 R13.2 R14.2 R15.2 R16.2 R21.2 R22.2 R23.2 R24.2 R29.2 R30.2 R31.2 R32.2 R38.1 R39.2 R40.2 U3.5(VOUT) U23.24(VCC) U24.1(VCC1)
+5V: C1.2 C2.2 C5.1 C6.2 C35.2 C38.2 R1.2 R41.2 R42.2 U1.1(+VIN) U2.3(VOUT) U22.1(VCC1) U24.8(VCC2)
+5V_ISO: C3.2 C4.2 C10.2 C12.2 C36.2 L1.2 U3.1(VIN) U3.3(EN) U4.5(EN) U4.8(IN) U22.16(VCC2)
+5V_ISO_LDO: C9.2 C13.2 C14.2 C15.2 C16.2 C17.2 C18.2 C19.2 C20.2 C21.2 C22.2 C23.2 C24.2 C25.2 C26.2 C27.2 C28.2 C29.2 C30.2 C31.2 C32.2 C33.2 R37.2 U4.1(OUT) U4.2(FB/SNS) U7.13(VCC) U8.13(VCC) U11.13(VCC) U12.13(VCC) U15.13(VCC) U16.13(VCC) U19.13(VCC) U20.13(VCC) U21.7(AVDD) U21.10(DVDD)
GND: C1.1 C2.1 C5.2 C6.1 C7.1 C8.1 C35.1 C38.1 DC1.2 DC1.3 R2.1 U1.2(-VIN) U2.4(PGND) U22.8(GND1) U24.5(GND2)
GND2: C3.1 C4.1 C9.1 C10.1 C11.1 C12.1 C13.1 C14.1 C15.1 C16.1 C17.1 C18.1 C19.1 C20.1 C21.1 C22.1 C23.1 C24.1 C25.1 C26.1 C27.1 C28.1 C29.1 C30.1 C31.1 C32.1 C33.1 C34.1 C36.1 C37.1 C39.1 R4.1 R11.1 R12.1 R19.1 R20.1 R27.1 R28.1 R35.1 R36.1 U1.4(-VOUT) U3.2(GND) U4.4(GND) U4.6(GND) U4.9(EP) U5.3(Case) U6.3(Case) U7.9(GND) U7.16(GND) U8.9(GND) U8.16(GND) U9.3(Case) U10.3(Case) U11.9(GND) U11.16(GND) U12.9(GND) U12.16(GND) U13.3(Case) U14.3(Case) U15.9(GND) U15.16(GND) U16.9(GND) U16.16(GND) U17.3(Case) U18.3(Case) U19.9(GND) U19.16(GND) U20.9(GND) U20.16(GND) U21.9(GND) U21.17(EP) U22.9(GND2) U23.1(A0) U23.2(A1) U23.12(GND) U23.21(A2) U24.4(GND1)
ADC_CS: U22.4(INC)
ADC_CS_ISO: R37.1 U21.11(CS#) U22.13(OUTC)
ADC_SCLK: U22.3(INB)
ADC_SCLK_ISO: U21.13(SCLK) U22.14(OUTB)
ADC_SDI: U22.2(INA)
ADC_SDI_ISO: U21.14(SDI) U22.15(OUTA)
ADC_SDO: U22.6(OUTE)
ADC_SDO_ISO: U21.12(SDO) U22.11(INE)
ADL_SCL1: R5.1 U7.6(SCL) U23.5(SC0)
ADL_SCL2: R7.1 U8.6(SCL) U23.7(SC1)
ADL_SCL3: R13.1 U11.6(SCL) U23.9(SC2)
ADL_SCL4: R15.1 U12.6(SCL) U23.11(SC3)
ADL_SCL5: R21.1 U15.6(SCL) U23.14(SC4)
ADL_SCL6: R23.1 U16.6(SCL) U23.16(SC5)
ADL_SCL7: R29.1 R31.1 U19.6(SCL) U20.6(SCL) U23.18(SC6)
ADL_SCL8: U23.20(SC7)
ADL_SDA1: R6.1 U7.5(SDA) U23.4(SD0)
ADL_SDA2: R8.1 U8.5(SDA) U23.6(SD1)
ADL_SDA3: R14.1 U11.5(SDA) U23.8(SD2)
ADL_SDA4: R16.1 U12.5(SDA) U23.10(SD3)
ADL_SDA5: R22.1 U15.5(SDA) U23.13(SD4)
ADL_SDA6: R24.1 U16.5(SDA) U23.15(SD5)
ADL_SDA7: R30.1 R32.1 U19.5(SDA) U20.5(SDA) U23.17(SD6)
ADL_SDA8: U23.19(SD7)
PCA_SCL: R42.1 U24.6(SCL2)
PCA_SCL_ISO: R40.1 U23.22(SCL) U24.3(SCL1)
PCA_SDA: R41.1 U24.7(SDA2)
PCA_SDA_ISO: R39.1 U23.23(SDA) U24.2(SDA1)
VLOG_OUT1: R9.1 U7.10(VLOG) U21.16(AIN1/GPIO1)
VLOG_OUT2: R10.1 U8.10(VLOG) U21.15(AIN0/GPIO0)
VLOG_OUT3: R17.1 U11.10(VLOG) U21.1(AIN2/GPIO2)
VLOG_OUT4: R18.1 U12.10(VLOG) U21.2(AIN3/GPIO3)
VLOG_OUT5: R25.1 U15.10(VLOG) U21.3(AIN4/GPIO4)
VLOG_OUT6: R26.1 U16.10(VLOG) U21.4(AIN5/GPIO5)
VLOG_OUT7: R33.1 U19.10(VLOG) U21.5(AIN6/GPIO6)
VLOG_OUT8: R34.1 U20.10(VLOG) U21.6(AIN7/GPIO7)
Net-(C7-2): C7.2 C8.2 D1.1(K) U2.1(VIN) U2.6(EN)
Net-(C34-2): C34.2 U21.8(REF)
Net-(D1-2): D1.2(A) DC1.4
Net-(L1-1): L1.1 U1.6(+VOUT)
Net-(R1-1): R1.1 R2.2 U2.7(FB)
Net-(R3-1): R3.1 R4.2 U3.4(ADJ/NC)
Net-(R9-2): R9.2 R11.2 U7.11(FB)
Net-(R10-2): R10.2 R12.2 U8.11(FB)
Net-(R17-2): R17.2 R19.2 U11.11(FB)
Net-(R18-2): R18.2 R20.2 U12.11(FB)
Net-(R25-2): R25.2 R27.2 U15.11(FB)
Net-(R26-2): R26.2 R28.2 U16.11(FB)
Net-(R33-2): R33.2 R35.2 U19.11(FB)
Net-(R34-2): R34.2 R36.2 U20.11(FB)
Net-(R38-2): R38.2 U23.3(RESET#)
Net-(U5-1): U5.1(CATHODE) U7.14(PDB)
Net-(U5-2): U5.2(ANODE) U7.2(INP)
Net-(U6-1): U6.1(CATHODE) U8.14(PDB)
Net-(U6-2): U6.2(ANODE) U8.2(INP)
Net-(U7-1): U7.1(SUM) U7.4(SUM) U7.15(SUM)
Net-(U8-1): U8.1(SUM) U8.4(SUM) U8.15(SUM)
Net-(U9-1): U9.1(CATHODE) U11.14(PDB)
Net-(U9-2): U9.2(ANODE) U11.2(INP)
Net-(U10-1): U10.1(CATHODE) U12.14(PDB)
Net-(U10-2): U10.2(ANODE) U12.2(INP)
Net-(U11-1): U11.1(SUM) U11.4(SUM) U11.15(SUM)
Net-(U12-1): U12.1(SUM) U12.4(SUM) U12.15(SUM)
Net-(U13-1): U13.1(CATHODE) U15.14(PDB)
Net-(U13-2): U13.2(ANODE) U15.2(INP)
Net-(U14-1): U14.1(CATHODE) U16.14(PDB)
Net-(U14-2): U14.2(ANODE) U16.2(INP)
Net-(U15-1): U15.1(SUM) U15.4(SUM) U15.15(SUM)
Net-(U16-1): U16.1(SUM) U16.4(SUM) U16.15(SUM)
Net-(U17-1): U17.1(CATHODE) U19.14(PDB)
Net-(U17-2): U17.2(ANODE) U19.2(INP)
Net-(U18-1): U18.1(CATHODE) U20.14(PDB)
Net-(U18-2): U18.2(ANODE) U20.2(INP)
Net-(U19-1): U19.1(SUM) U19.4(SUM) U19.15(SUM)
Net-(U20-1): U20.1(SUM) U20.4(SUM) U20.15(SUM)

Not connected (* = marked no-connect by the designer): U2 2(SW) 5(PG); U4 3(NC) 7(NC); U7 3(IREF) 7(CREF) 8(CMP) 12(HYST); U8 3(IREF) 7(CREF) 8(CMP) 12(HYST); U11 3(IREF) 7(CREF) 8(CMP) 12(HYST); U12 3(IREF) 7(CREF) 8(CMP) 12(HYST); U15 3(IREF) 7(CREF) 8(CMP) 12(HYST); U16 3(IREF) 7(CREF) 8(CMP) 12(HYST); U19 3(IREF) 7(CREF) 8(CMP) 12(HYST); U20 3(IREF) 7(CREF) 8(CMP) 12(HYST); U22 5(IND) 7(OUTF) 10(INF) 12(OUTD)

## Notes on the sheets
sheet 1
- Tensão de alimentação 7V a 15V
